# EAGLE design PCB_EstAcqua_EAGLE (EAGLE 8.7.1)
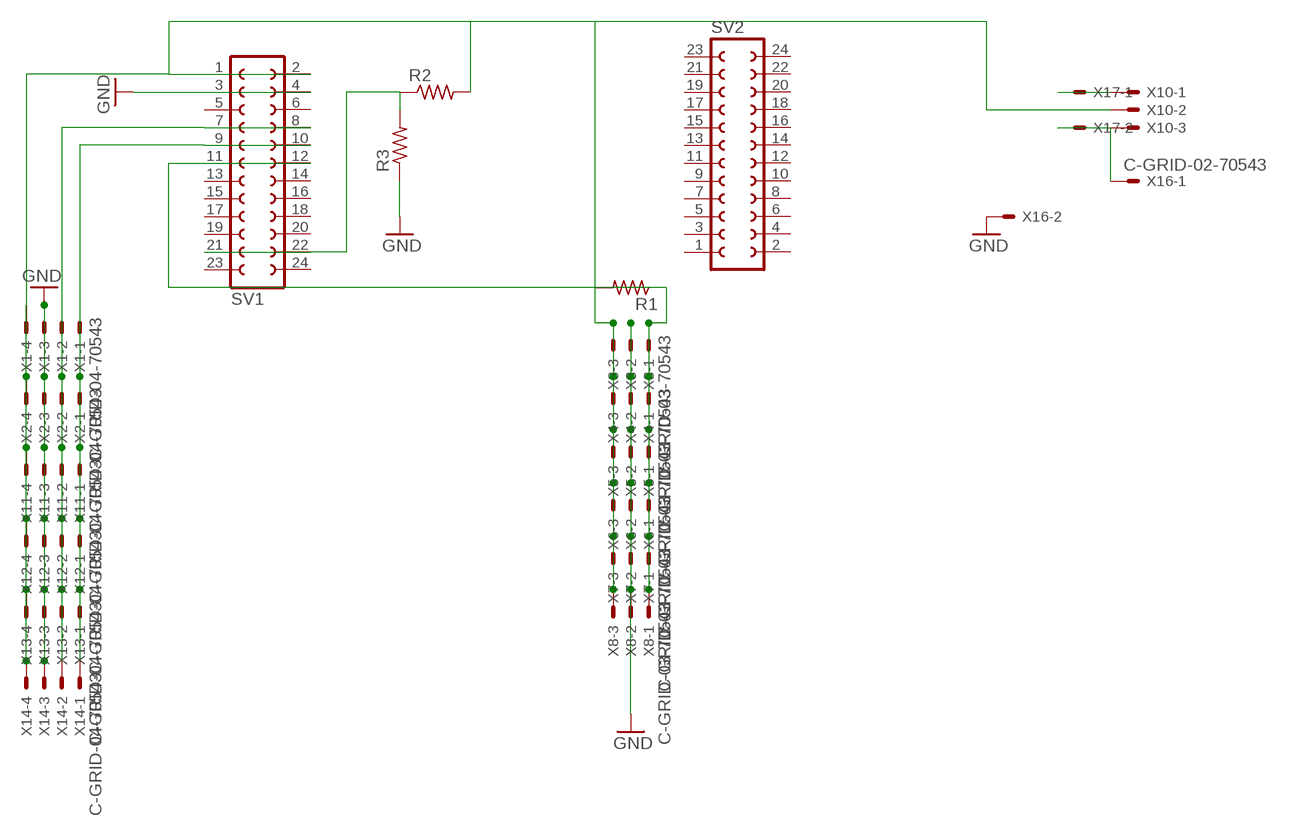
[diagram p0: schematic, sheet 1]

## Parts
R1  R-US_0207/15  [0207/15]
R2  R-US_0207/10  [0207/10]
R3  R-US_0207/10  [0207/10]
SV1  FE12-2W  [FE12-2W]
SV2  FE12-2W  [FE12-2W]
X1  C-GRID-04-70543  [70543-04]
X2  C-GRID-04-70543  [70543-04]
X3  C-GRID-03-70543  [70543-03]
X4  C-GRID-03-70543  [70543-03]
X5  C-GRID-03-70543  [70543-03]
X6  C-GRID-03-70543  [70543-03]
X7  C-GRID-03-70543  [70543-03]
X8  C-GRID-03-70543  [70543-03]
X10  KK-156-3  [KK-156-3]
X11  C-GRID-04-70543  [70543-04]
X12  C-GRID-04-70543  [70543-04]
X13  C-GRID-04-70543  [70543-04]
X14  C-GRID-04-70543  [70543-04]
X16  C-GRID-02-70543  [70543-02]
X17  KK-156-2  [KK-156-2]

## Nets
GND: R3.1 SV1.3 SV1.4 X1.3 X2.3 X3.2 X4.2 X5.2 X6.2 X7.2 X8.2 X11.3 X12.3 X13.3 X14.3 X16.2
N$1: X10.1 X17.1
N$2: R2.1 R3.2 SV1.21 SV1.22
N$3: X10.3 X16.1 X17.2
N$4: SV1.9 SV1.10 X1.1 X2.1 X11.1 X12.1 X13.1 X14.1
N$5: R1.1 SV1.11 SV1.12 X3.1 X4.1 X5.1 X6.1 X7.1 X8.1
N$7: SV1.7 SV1.8 X1.2 X2.2 X11.2 X12.2 X13.2 X14.2
VCC: R1.2 R2.2 SV1.1 SV1.2 X1.4 X2.4 X3.3 X4.3 X5.3 X6.3 X7.3 X8.3 X10.2 X11.4 X12.4 X13.4 X14.4
Unconnected: SV1.5 SV1.6 SV1.13 SV1.14 SV1.15 SV1.16 SV1.17 SV1.18 SV1.19 SV1.20 SV1.23 SV1.24 SV2.1 SV2.2 SV2.3 SV2.4 SV2.5 SV2.6 SV2.7 SV2.8 SV2.9 SV2.10 SV2.11 SV2.12 SV2.13 SV2.14 SV2.15 SV2.16 SV2.17 SV2.18 SV2.19 SV2.20 SV2.21 SV2.22 SV2.23 SV2.24

## Library data of the parts
R1 = resistor:R-US_: RESISTOR, American symbol
R2 R3 = rcl:R-US_: RESISTOR, American symbol; SPICEPREFIX: R
SV1 SV2 = con-lsta:FE12-2W: FEMALE HEADER; OC_FARNELL: unknown; OC_NEWARK: unknown
X1 X2 X11-X14 = con-molex:C-GRID-04: CONNECTOR wire to board 2.54 mm (0.100") pitch header; MF: MOLEX; OC_FARNELL: unknown; OC_NEWARK: unknown
X3-X8 = con-molex:C-GRID-03: CONNECTOR wire to board 2.54 mm (0.100") pitch header; MF: MOLEX; OC_FARNELL: unknown; OC_NEWARK: unknown
X10 = con-molex:KK-156-3: KK 156 HEADER Source: http://www.molex.com/pdm_docs/sd/026604100_sd.pdf; MF: MOLEX; OC_FARNELL: unknown; OC_NEWARK: unknown
X16 = con-molex:C-GRID-02: CONNECTOR wire to board 2.54 mm (0.100") pitch header; MF: MOLEX; OC_FARNELL: unknown; OC_NEWARK: unknown
X17 = con-molex:KK-156-2: KK 156 HEADER Source: http://www.molex.com/pdm_docs/sd/026604100_sd.pdf; MF: MOLEX; OC_FARNELL: unknown; OC_NEWARK: unknown

## Board
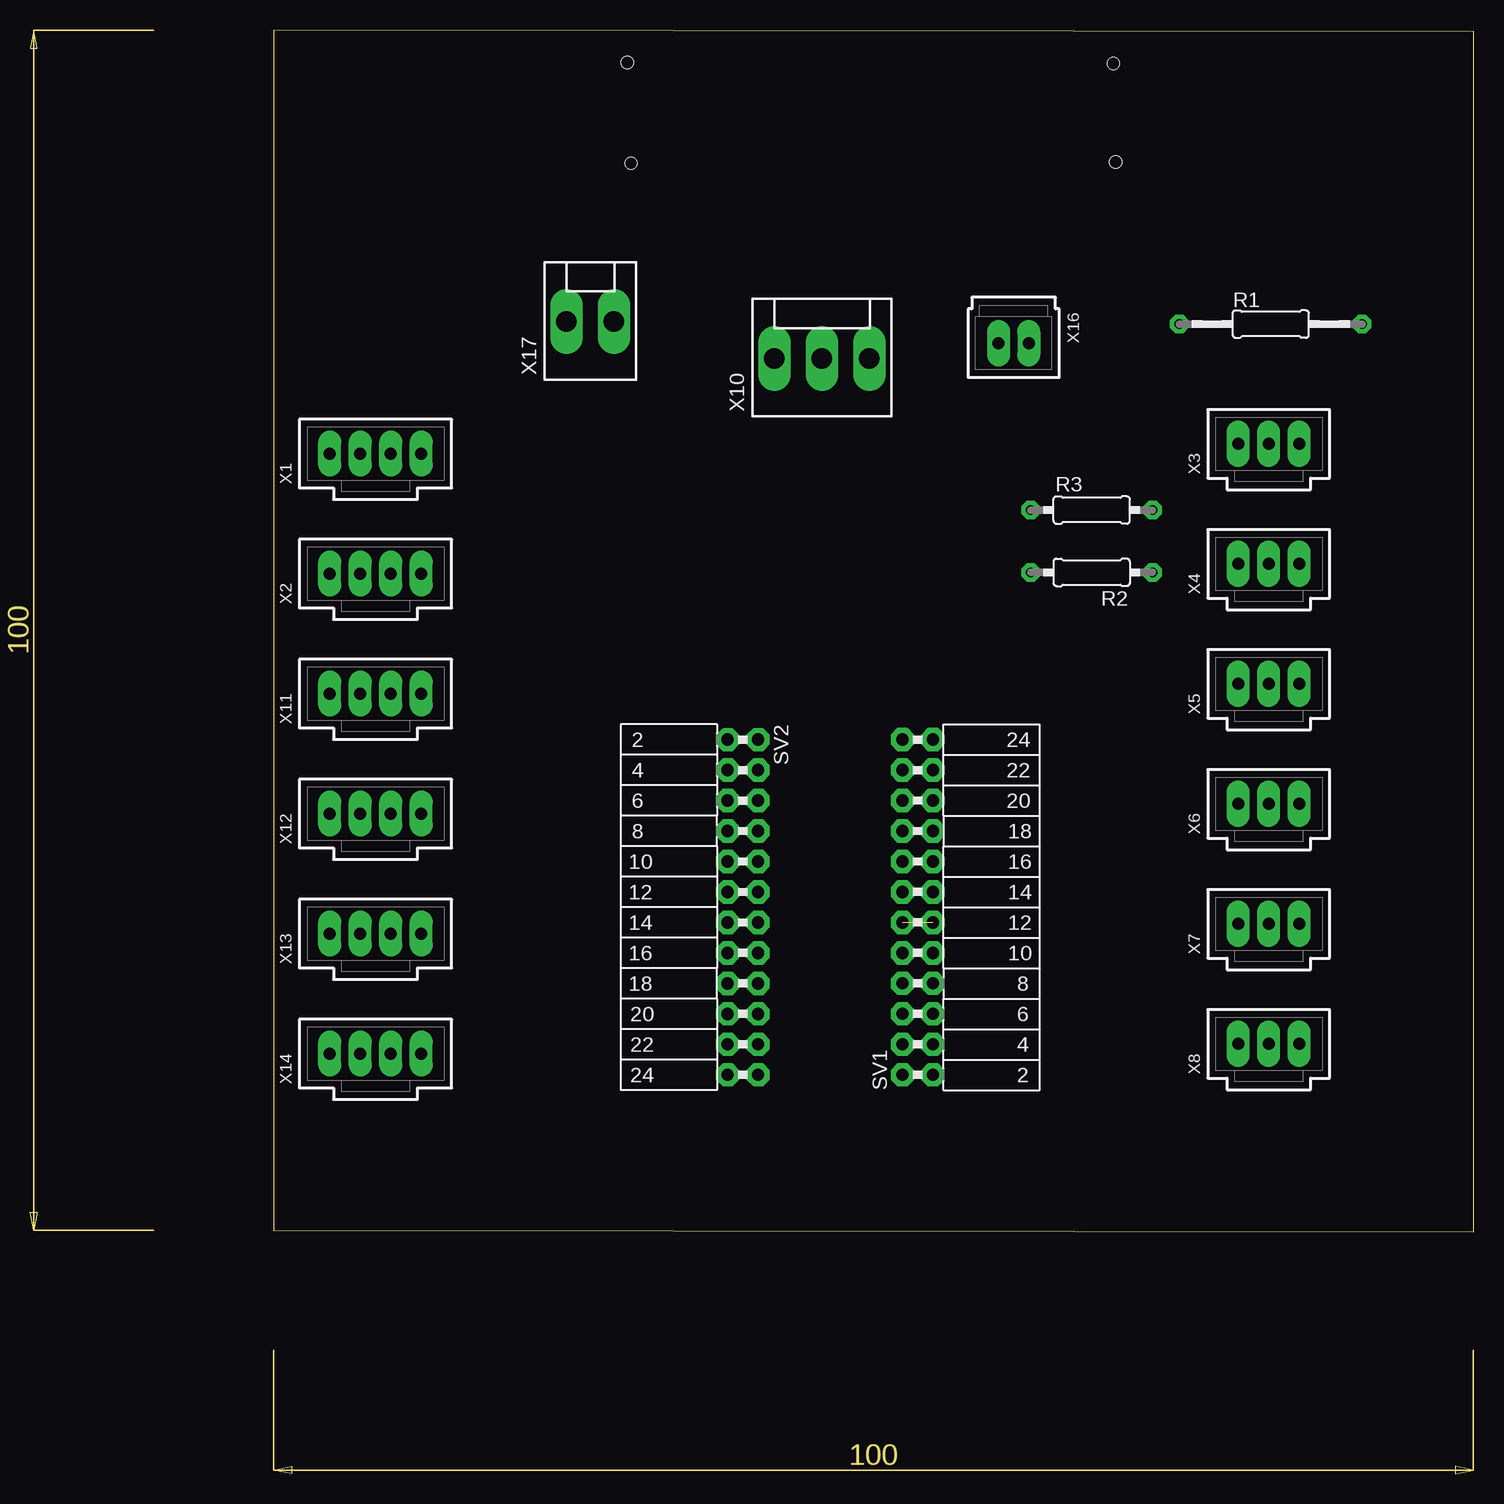
[diagram p1: board, top side]
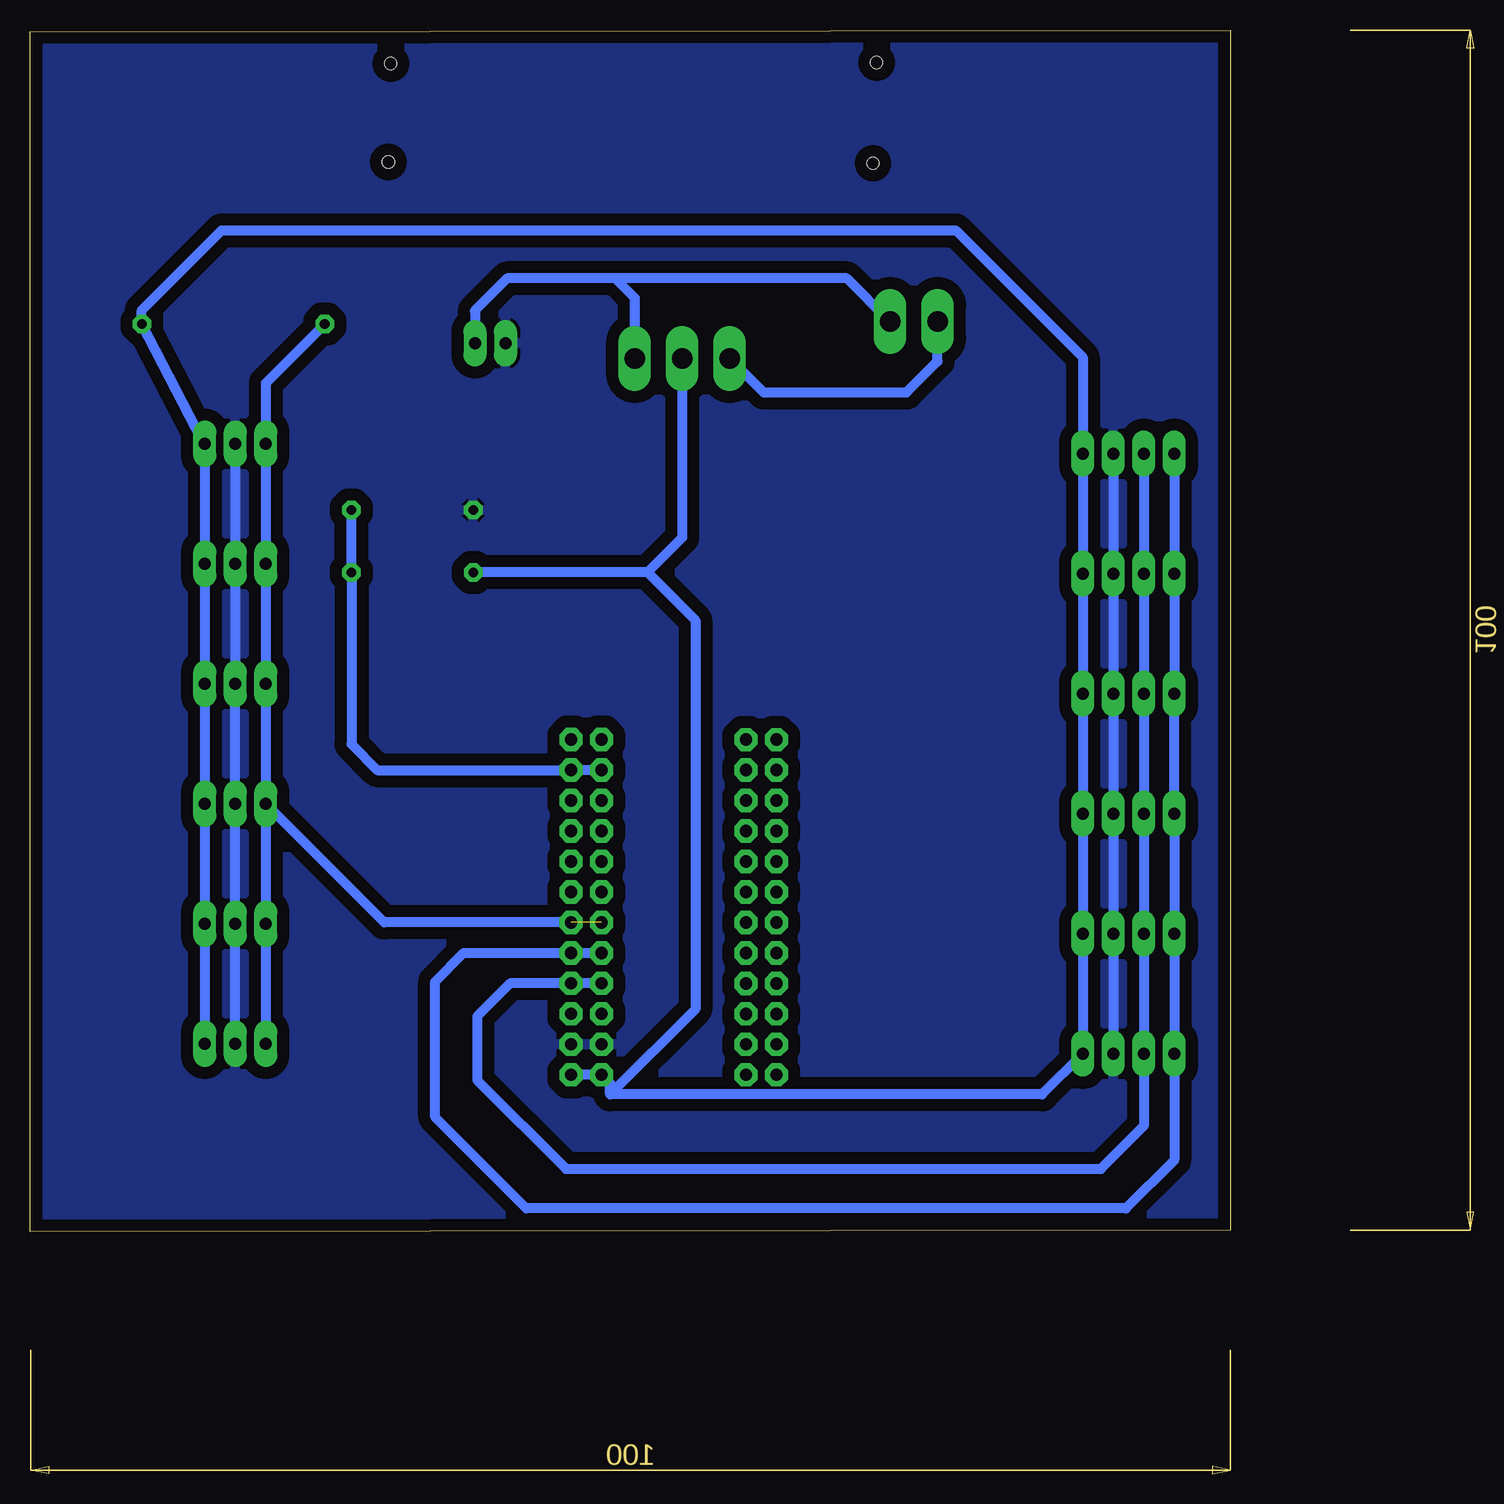
[diagram p2: board, bottom side, seen from below]

Size 100.07 x 100.15 mm. Coordinates in mm from the lower left corner, seen from the top.
Outline: 0,0.15 100.07,0 100.07,100 0,100.15 0,0.15
Copper layers (1*16): Top 0.035mm / dielectric 1.5mm / Bottom 0.035mm
Design rules "default *": minimum track width 6mil, minimum drill 0.35mm, track to track 6mil, track to pad 6mil, pad to pad 6mil, via to via 6mil, smd to smd 6mil, copper to edge 40mil, drill to drill 6mil, minimum pad ring 10mil, minimum via ring 8mil, stop-mask expansion 4mil, vias tented up to drill 0mil, thermal gap 10mil
Holes 1 mm at 29.5,97.45 29.8,89.05 70,97.35 70.2,89.15

### Footprints (pad centres in the part's own frame; a part is rotated, then mirrored left to right if it is on the bottom)
0207/15 = drill 0.813 octagon: 1 -7.62,0; 2 7.62,0
0207/10 = drill 0.813 octagon: 1 -5.08,0; 2 5.08,0
FE12-2W = drill 1.016 octagon: 1 -13.97,1.27; 2 -13.97,-1.27; 3 -11.43,1.27; 4 -11.43,-1.27; 5 -8.89,1.27; 6 -8.89,-1.27; 7 -6.35,1.27; 8 -6.35,-1.27; 9 -3.81,1.27; 10 -3.81,-1.27; 11 -1.27,1.27; 12 -1.27,-1.27; 13 1.27,1.27; 14 1.27,-1.27; 15 3.81,1.27; 16 3.81,-1.27; 17 6.35,1.27; 18 6.35,-1.27; 19 8.89,1.27; 20 8.89,-1.27; 21 11.43,1.27; 22 11.43,-1.27; 23 13.97,1.27; 24 13.97,-1.27
70543-04 = drill 1.016 long: 1 -3.81,0; 2 -1.27,0; 3 1.27,0; 4 3.81,0
70543-03 = drill 1.016 long: 1 -2.54,0; 2 0,0; 3 2.54,0
KK-156-3 = drill 1.7 pad 2.184 long: 1 -3.96,0; 2 0,0; 3 3.96,0
70543-02 = drill 1.016 long: 1 -1.27,0; 2 1.27,0
KK-156-2 = drill 1.7 pad 2.184 long: 1 -1.98,0; 2 1.98,0

### Placement (x,y rotation side)
R1  83.13,75.64 0 top
R2  68.2,54.95 180 top
R3  68.2,60.15 0 top
SV1  53.7,27.05 90 top
SV2  39.13,27.04 270 top
X1  8.5,64.85 0 top
X2  8.5,54.85 0 top
X3  82.97,65.66 0 top
X4  82.97,55.66 0 top
X5  82.97,45.66 0 top
X6  82.97,35.66 0 top
X7  82.97,25.66 0 top
X8  82.97,15.66 0 top
X10  45.71,72.79 0 top
X11  8.5,44.85 0 top
X12  8.5,34.85 0 top
X13  8.5,24.85 0 top
X14  8.5,14.85 0 top
X16  61.7,74.05 180 top
X17  26.4,75.85 0 top

### Tracks (layer width: path | path; a pad name or v marks a point on that pad's centre or on a via)
GND
  Bottom 0.813: X14.3 X13.3 X12.3 X11.3 X2.3 X1.3 | X3.2 X4.2 X5.2 X6.2 X7.2 X8.2
  pour Bottom (isolate 1.016): 100.2,99.85 100.2,0.15 0,0.15 0,99.45 0.6,99.45
N$1
  Bottom 0.813: X10.1 38.91,69.95 27,69.95 24.42,72.53 X17.1
N$2
  Bottom 0.813: SV1.21 SV1.22 71.13,38.48 73.28,40.63 R2.1 R3.2
N$3
  Bottom 0.813: X17.2 31.98,79.45 51.3,79.45 | 51.3,79.45 60.3,79.45 63,76.75 62.97,76.72 X16.1 | 51.3,79.45 49.67,77.82 X10.3
N$4
  Bottom 0.813: X1.1 X2.1 X11.1 X12.1 X13.1 X14.1 4.69,5.96 8.7,1.95 58.7,1.95 66.3,9.55 66.3,20.85 63.91,23.24 SV1.10 SV1.9
N$5  (1 unrouted)
  Bottom 0.813: X6.1 X5.1 X4.1 X3.1 80.42,70.72 R1.1 | X6.1 X7.1 X8.1 | SV1.12 70.54,25.78 X6.1
N$7
  Bottom 0.813: X14.2 X13.2 X12.2 X11.2 X2.2 X1.2 | 7.3,14.78 X14.2 | X14.2 7.23,8.82 10.8,5.25 55.4,5.25 62.8,12.65 62.8,17.95 60.05,20.7 SV1.8 SV1.7
VCC
  Bottom 0.813: 12.31,64.45 X1.4 12.31,72.86 22.9,83.45 84.1,83.45 90.75,76.8 R1.2 85.69,65.85 X3.3 X4.3 X5.3 X6.3 | 12.31,64.45 X2.4 X11.4 X12.4 X13.4 X14.4 15.71,11.45 51.7,11.45 | 12.3,64.46 12.31,64.45 | 85.77,34.96 85.5,35.22 X6.3 | X6.3 X7.3 X8.3 | 54.97,12.92 SV1.2 SV1.1 51.7,12.35 51.7,11.45 | 48.6,54.95 R2.2 | 51.7,11.45 44.6,18.55 44.6,50.95 48.6,54.95 | X10.2 45.71,57.84 48.6,54.95